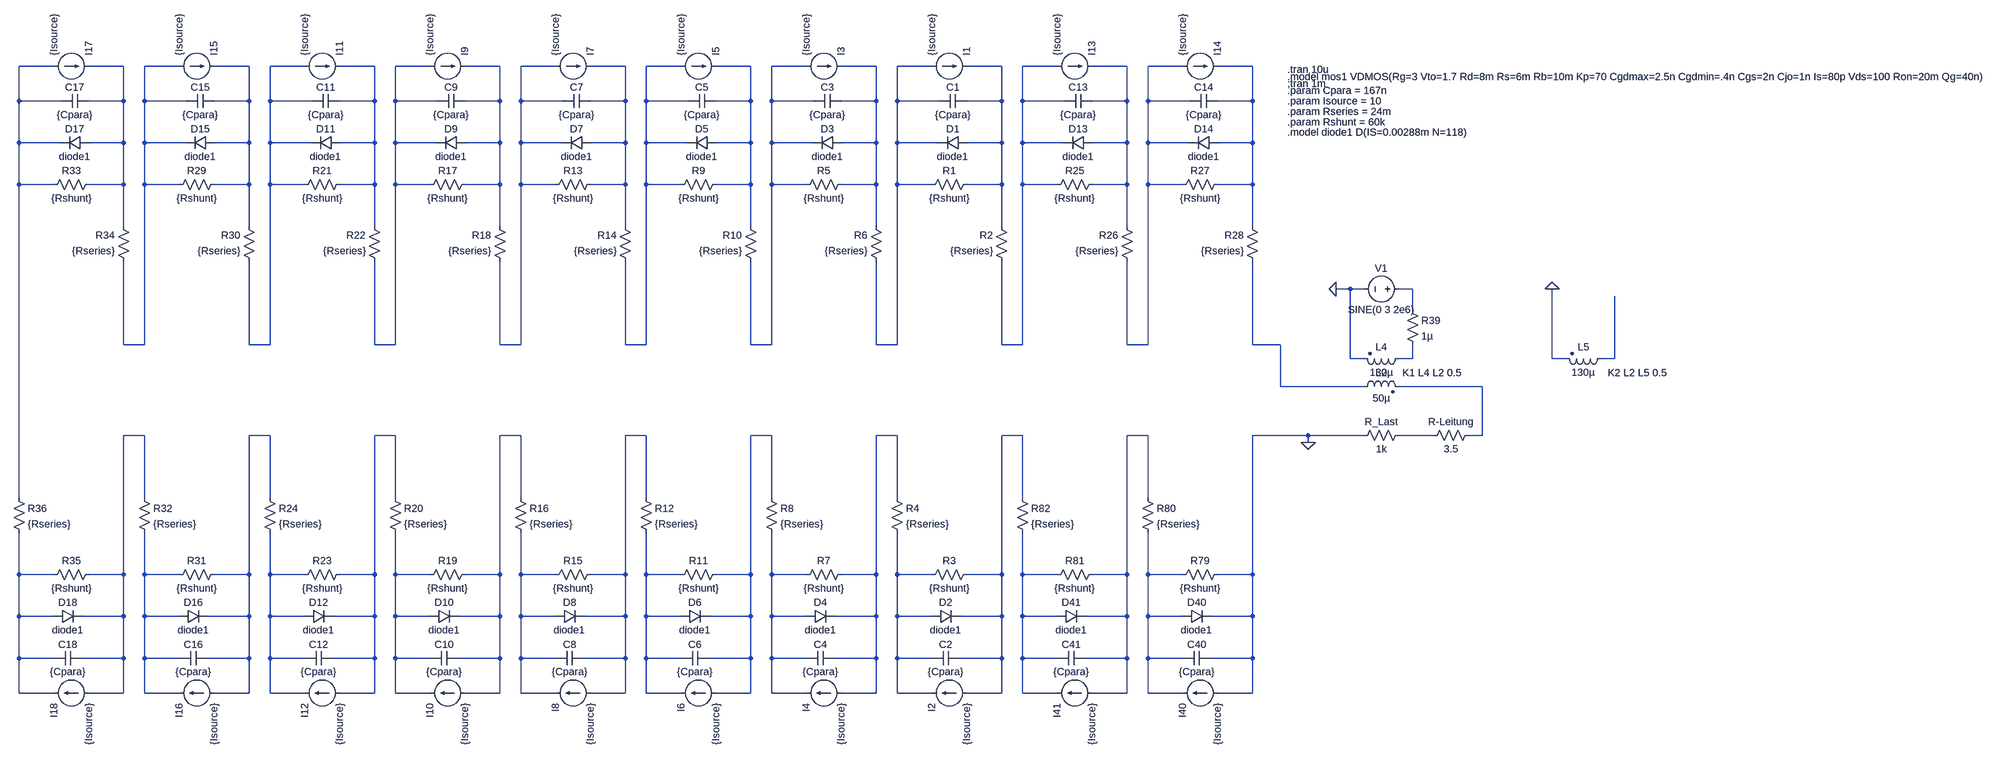
[diagram p0: schematic module-string-complete.asc]
module-string-complete.asc, the LTspice schematic file:
Version 4
SHEET 1 4972 1200
WIRE 1072 -384 992 -384
WIRE 1232 -384 1152 -384
WIRE 1360 -384 1280 -384
WIRE 1520 -384 1440 -384
WIRE 1648 -384 1568 -384
WIRE 1808 -384 1728 -384
WIRE 1936 -384 1856 -384
WIRE 2096 -384 2016 -384
WIRE 2224 -384 2144 -384
WIRE 2384 -384 2304 -384
WIRE 2512 -384 2432 -384
WIRE 2672 -384 2592 -384
WIRE 2800 -384 2720 -384
WIRE 2960 -384 2880 -384
WIRE 3088 -384 3008 -384
WIRE 3248 -384 3168 -384
WIRE 3376 -384 3296 -384
WIRE 3536 -384 3456 -384
WIRE 3664 -384 3584 -384
WIRE 3824 -384 3744 -384
WIRE 992 -304 992 -384
WIRE 1088 -304 992 -304
WIRE 1232 -304 1232 -384
WIRE 1232 -304 1152 -304
WIRE 1280 -304 1280 -384
WIRE 1376 -304 1280 -304
WIRE 1520 -304 1520 -384
WIRE 1520 -304 1440 -304
WIRE 1568 -304 1568 -384
WIRE 1664 -304 1568 -304
WIRE 1808 -304 1808 -384
WIRE 1808 -304 1728 -304
WIRE 1856 -304 1856 -384
WIRE 1952 -304 1856 -304
WIRE 2096 -304 2096 -384
WIRE 2096 -304 2016 -304
WIRE 2144 -304 2144 -384
WIRE 2240 -304 2144 -304
WIRE 2384 -304 2384 -384
WIRE 2384 -304 2304 -304
WIRE 2432 -304 2432 -384
WIRE 2528 -304 2432 -304
WIRE 2672 -304 2672 -384
WIRE 2672 -304 2592 -304
WIRE 2720 -304 2720 -384
WIRE 2816 -304 2720 -304
WIRE 2960 -304 2960 -384
WIRE 2960 -304 2880 -304
WIRE 3008 -304 3008 -384
WIRE 3104 -304 3008 -304
WIRE 3248 -304 3248 -384
WIRE 3248 -304 3168 -304
WIRE 3296 -304 3296 -384
WIRE 3392 -304 3296 -304
WIRE 3536 -304 3536 -384
WIRE 3536 -304 3456 -304
WIRE 3584 -304 3584 -384
WIRE 3680 -304 3584 -304
WIRE 3824 -304 3824 -384
WIRE 3824 -304 3744 -304
WIRE 992 -208 992 -304
WIRE 1088 -208 992 -208
WIRE 1232 -208 1232 -304
WIRE 1232 -208 1152 -208
WIRE 1280 -208 1280 -304
WIRE 1376 -208 1280 -208
WIRE 1520 -208 1520 -304
WIRE 1520 -208 1440 -208
WIRE 1568 -208 1568 -304
WIRE 1664 -208 1568 -208
WIRE 1808 -208 1808 -304
WIRE 1808 -208 1728 -208
WIRE 1856 -208 1856 -304
WIRE 1952 -208 1856 -208
WIRE 2096 -208 2096 -304
WIRE 2096 -208 2016 -208
WIRE 2144 -208 2144 -304
WIRE 2240 -208 2144 -208
WIRE 2384 -208 2384 -304
WIRE 2384 -208 2304 -208
WIRE 2432 -208 2432 -304
WIRE 2528 -208 2432 -208
WIRE 2672 -208 2672 -304
WIRE 2672 -208 2592 -208
WIRE 2720 -208 2720 -304
WIRE 2816 -208 2720 -208
WIRE 2960 -208 2960 -304
WIRE 2960 -208 2880 -208
WIRE 3008 -208 3008 -304
WIRE 3104 -208 3008 -208
WIRE 3248 -208 3248 -304
WIRE 3248 -208 3168 -208
WIRE 3296 -208 3296 -304
WIRE 3392 -208 3296 -208
WIRE 3536 -208 3536 -304
WIRE 3536 -208 3456 -208
WIRE 3584 -208 3584 -304
WIRE 3680 -208 3584 -208
WIRE 3824 -208 3824 -304
WIRE 3824 -208 3744 -208
WIRE 992 -112 992 -208
WIRE 1072 -112 992 -112
WIRE 1232 -112 1232 -208
WIRE 1232 -112 1152 -112
WIRE 1280 -112 1280 -208
WIRE 1360 -112 1280 -112
WIRE 1520 -112 1520 -208
WIRE 1520 -112 1440 -112
WIRE 1568 -112 1568 -208
WIRE 1648 -112 1568 -112
WIRE 1808 -112 1808 -208
WIRE 1808 -112 1728 -112
WIRE 1856 -112 1856 -208
WIRE 1936 -112 1856 -112
WIRE 2096 -112 2096 -208
WIRE 2096 -112 2016 -112
WIRE 2144 -112 2144 -208
WIRE 2224 -112 2144 -112
WIRE 2384 -112 2384 -208
WIRE 2384 -112 2304 -112
WIRE 2432 -112 2432 -208
WIRE 2512 -112 2432 -112
WIRE 2672 -112 2672 -208
WIRE 2672 -112 2592 -112
WIRE 2720 -112 2720 -208
WIRE 2800 -112 2720 -112
WIRE 2960 -112 2960 -208
WIRE 2960 -112 2880 -112
WIRE 3008 -112 3008 -208
WIRE 3088 -112 3008 -112
WIRE 3248 -112 3248 -208
WIRE 3248 -112 3168 -112
WIRE 3296 -112 3296 -208
WIRE 3376 -112 3296 -112
WIRE 3536 -112 3536 -208
WIRE 3536 -112 3456 -112
WIRE 3584 -112 3584 -208
WIRE 3664 -112 3584 -112
WIRE 3824 -112 3824 -208
WIRE 3824 -112 3744 -112
WIRE 1232 -16 1232 -112
WIRE 1520 -16 1520 -112
WIRE 1808 -16 1808 -112
WIRE 2096 -16 2096 -112
WIRE 2384 -16 2384 -112
WIRE 2672 -16 2672 -112
WIRE 2960 -16 2960 -112
WIRE 3248 -16 3248 -112
WIRE 3536 -16 3536 -112
WIRE 3824 -16 3824 -112
WIRE 4048 128 4016 128
WIRE 4080 128 4048 128
WIRE 4192 128 4160 128
WIRE 4192 176 4192 128
WIRE 1232 256 1232 64
WIRE 1280 256 1280 -112
WIRE 1280 256 1232 256
WIRE 1520 256 1520 64
WIRE 1568 256 1568 -112
WIRE 1568 256 1520 256
WIRE 1808 256 1808 64
WIRE 1856 256 1856 -112
WIRE 1856 256 1808 256
WIRE 2096 256 2096 64
WIRE 2144 256 2144 -112
WIRE 2144 256 2096 256
WIRE 2384 256 2384 64
WIRE 2432 256 2432 -112
WIRE 2432 256 2384 256
WIRE 2672 256 2672 64
WIRE 2720 256 2720 -112
WIRE 2720 256 2672 256
WIRE 2960 256 2960 64
WIRE 3008 256 3008 -112
WIRE 3008 256 2960 256
WIRE 3248 256 3248 64
WIRE 3296 256 3296 -112
WIRE 3296 256 3248 256
WIRE 3536 256 3536 64
WIRE 3584 256 3584 -112
WIRE 3584 256 3536 256
WIRE 3824 256 3824 64
WIRE 3888 256 3824 256
WIRE 4048 288 4048 128
WIRE 4080 288 4048 288
WIRE 4192 288 4192 256
WIRE 4192 288 4160 288
WIRE 4512 288 4512 128
WIRE 4544 288 4512 288
WIRE 4656 288 4656 144
WIRE 4656 288 4624 288
WIRE 3888 352 3888 256
WIRE 4080 352 3888 352
WIRE 4352 352 4160 352
WIRE 1280 464 1232 464
WIRE 1568 464 1520 464
WIRE 1856 464 1808 464
WIRE 2144 464 2096 464
WIRE 2432 464 2384 464
WIRE 2720 464 2672 464
WIRE 3008 464 2960 464
WIRE 3296 464 3248 464
WIRE 3584 464 3536 464
WIRE 3952 464 3824 464
WIRE 4080 464 3952 464
WIRE 4240 464 4160 464
WIRE 4352 464 4352 352
WIRE 4352 464 4320 464
WIRE 3952 480 3952 464
WIRE 992 656 992 -112
WIRE 1280 656 1280 464
WIRE 1568 656 1568 464
WIRE 1856 656 1856 464
WIRE 2144 656 2144 464
WIRE 2432 656 2432 464
WIRE 2720 656 2720 464
WIRE 3008 656 3008 464
WIRE 3296 656 3296 464
WIRE 3584 656 3584 464
WIRE 992 832 992 736
WIRE 1072 832 992 832
WIRE 1232 832 1232 464
WIRE 1232 832 1152 832
WIRE 1280 832 1280 736
WIRE 1360 832 1280 832
WIRE 1520 832 1520 464
WIRE 1520 832 1440 832
WIRE 1568 832 1568 736
WIRE 1648 832 1568 832
WIRE 1808 832 1808 464
WIRE 1808 832 1728 832
WIRE 1856 832 1856 736
WIRE 1936 832 1856 832
WIRE 2096 832 2096 464
WIRE 2096 832 2016 832
WIRE 2144 832 2144 736
WIRE 2224 832 2144 832
WIRE 2384 832 2384 464
WIRE 2384 832 2304 832
WIRE 2432 832 2432 736
WIRE 2512 832 2432 832
WIRE 2672 832 2672 464
WIRE 2672 832 2592 832
WIRE 2720 832 2720 736
WIRE 2800 832 2720 832
WIRE 2960 832 2960 464
WIRE 2960 832 2880 832
WIRE 3008 832 3008 736
WIRE 3088 832 3008 832
WIRE 3248 832 3248 464
WIRE 3248 832 3168 832
WIRE 3296 832 3296 736
WIRE 3376 832 3296 832
WIRE 3536 832 3536 464
WIRE 3536 832 3456 832
WIRE 3584 832 3584 736
WIRE 3664 832 3584 832
WIRE 3824 832 3824 464
WIRE 3824 832 3744 832
WIRE 992 928 992 832
WIRE 1072 928 992 928
WIRE 1232 928 1232 832
WIRE 1232 928 1136 928
WIRE 1280 928 1280 832
WIRE 1360 928 1280 928
WIRE 1520 928 1520 832
WIRE 1520 928 1424 928
WIRE 1568 928 1568 832
WIRE 1648 928 1568 928
WIRE 1808 928 1808 832
WIRE 1808 928 1712 928
WIRE 1856 928 1856 832
WIRE 1936 928 1856 928
WIRE 2096 928 2096 832
WIRE 2096 928 2000 928
WIRE 2144 928 2144 832
WIRE 2224 928 2144 928
WIRE 2384 928 2384 832
WIRE 2384 928 2288 928
WIRE 2432 928 2432 832
WIRE 2512 928 2432 928
WIRE 2672 928 2672 832
WIRE 2672 928 2576 928
WIRE 2720 928 2720 832
WIRE 2800 928 2720 928
WIRE 2960 928 2960 832
WIRE 2960 928 2864 928
WIRE 3008 928 3008 832
WIRE 3088 928 3008 928
WIRE 3248 928 3248 832
WIRE 3248 928 3152 928
WIRE 3296 928 3296 832
WIRE 3376 928 3296 928
WIRE 3536 928 3536 832
WIRE 3536 928 3440 928
WIRE 3584 928 3584 832
WIRE 3664 928 3584 928
WIRE 3824 928 3824 832
WIRE 3824 928 3728 928
WIRE 992 1024 992 928
WIRE 1072 1024 992 1024
WIRE 1232 1024 1232 928
WIRE 1232 1024 1136 1024
WIRE 1280 1024 1280 928
WIRE 1360 1024 1280 1024
WIRE 1520 1024 1520 928
WIRE 1520 1024 1424 1024
WIRE 1568 1024 1568 928
WIRE 1648 1024 1568 1024
WIRE 1808 1024 1808 928
WIRE 1808 1024 1712 1024
WIRE 1856 1024 1856 928
WIRE 1936 1024 1856 1024
WIRE 2096 1024 2096 928
WIRE 2096 1024 2000 1024
WIRE 2144 1024 2144 928
WIRE 2224 1024 2144 1024
WIRE 2384 1024 2384 928
WIRE 2384 1024 2288 1024
WIRE 2432 1024 2432 928
WIRE 2512 1024 2432 1024
WIRE 2672 1024 2672 928
WIRE 2672 1024 2576 1024
WIRE 2720 1024 2720 928
WIRE 2800 1024 2720 1024
WIRE 2960 1024 2960 928
WIRE 2960 1024 2864 1024
WIRE 3008 1024 3008 928
WIRE 3088 1024 3008 1024
WIRE 3248 1024 3248 928
WIRE 3248 1024 3152 1024
WIRE 3296 1024 3296 928
WIRE 3376 1024 3296 1024
WIRE 3536 1024 3536 928
WIRE 3536 1024 3440 1024
WIRE 3584 1024 3584 928
WIRE 3664 1024 3584 1024
WIRE 3824 1024 3824 928
WIRE 3824 1024 3728 1024
WIRE 992 1104 992 1024
WIRE 1072 1104 992 1104
WIRE 1232 1104 1232 1024
WIRE 1232 1104 1152 1104
WIRE 1280 1104 1280 1024
WIRE 1360 1104 1280 1104
WIRE 1520 1104 1520 1024
WIRE 1520 1104 1440 1104
WIRE 1568 1104 1568 1024
WIRE 1648 1104 1568 1104
WIRE 1808 1104 1808 1024
WIRE 1808 1104 1728 1104
WIRE 1856 1104 1856 1024
WIRE 1936 1104 1856 1104
WIRE 2096 1104 2096 1024
WIRE 2096 1104 2016 1104
WIRE 2144 1104 2144 1024
WIRE 2224 1104 2144 1104
WIRE 2384 1104 2384 1024
WIRE 2384 1104 2304 1104
WIRE 2432 1104 2432 1024
WIRE 2512 1104 2432 1104
WIRE 2672 1104 2672 1024
WIRE 2672 1104 2592 1104
WIRE 2720 1104 2720 1024
WIRE 2800 1104 2720 1104
WIRE 2960 1104 2960 1024
WIRE 2960 1104 2880 1104
WIRE 3008 1104 3008 1024
WIRE 3088 1104 3008 1104
WIRE 3248 1104 3248 1024
WIRE 3248 1104 3168 1104
WIRE 3296 1104 3296 1024
WIRE 3376 1104 3296 1104
WIRE 3536 1104 3536 1024
WIRE 3536 1104 3456 1104
WIRE 3584 1104 3584 1024
WIRE 3664 1104 3584 1104
WIRE 3824 1104 3824 1024
WIRE 3824 1104 3744 1104
FLAG 3952 480 0
FLAG 4016 128 0
FLAG 4512 128 0
SYMBOL current 3376 -384 R270
WINDOW 0 24 80 Left 2
WINDOW 3 24 0 Left 2
WINDOW 123 0 0 Left 2
WINDOW 39 0 0 Left 2
SYMATTR InstName I13
SYMATTR Value {Isource}
SYMBOL cap 3456 -320 R90
WINDOW 0 0 32 VBottom 2
WINDOW 3 32 32 VTop 2
SYMATTR InstName C13
SYMATTR Value {Cpara}
SYMBOL diode 3456 -224 R90
WINDOW 0 0 32 VBottom 2
WINDOW 3 32 32 VTop 2
SYMATTR InstName D13
SYMATTR Value diode1
SYMBOL res 3472 -128 R90
WINDOW 0 0 56 VBottom 2
WINDOW 3 32 56 VTop 2
SYMATTR InstName R25
SYMATTR Value {Rshunt}
SYMBOL res 3552 80 R180
WINDOW 0 36 76 Left 2
WINDOW 3 36 40 Left 2
SYMATTR InstName R26
SYMATTR Value {Rseries}
SYMBOL current 3664 -384 R270
WINDOW 0 24 80 Left 2
WINDOW 3 24 0 Left 2
WINDOW 123 0 0 Left 2
WINDOW 39 0 0 Left 2
SYMATTR InstName I14
SYMATTR Value {Isource}
SYMBOL cap 3744 -320 R90
WINDOW 0 0 32 VBottom 2
WINDOW 3 32 32 VTop 2
SYMATTR InstName C14
SYMATTR Value {Cpara}
SYMBOL diode 3744 -224 R90
WINDOW 0 0 32 VBottom 2
WINDOW 3 32 32 VTop 2
SYMATTR InstName D14
SYMATTR Value diode1
SYMBOL res 3760 -128 R90
WINDOW 0 0 56 VBottom 2
WINDOW 3 32 56 VTop 2
SYMATTR InstName R27
SYMATTR Value {Rshunt}
SYMBOL res 3840 80 R180
WINDOW 0 36 76 Left 2
WINDOW 3 36 40 Left 2
SYMATTR InstName R28
SYMATTR Value {Rseries}
SYMBOL current 3744 1104 R90
WINDOW 0 24 80 Left 2
WINDOW 3 24 0 Left 2
WINDOW 123 0 0 Left 2
WINDOW 39 0 0 Left 2
SYMATTR InstName I40
SYMATTR Value {Isource}
SYMBOL cap 3664 1040 R270
WINDOW 0 32 32 VTop 2
WINDOW 3 0 32 VBottom 2
SYMATTR InstName C40
SYMATTR Value {Cpara}
SYMBOL diode 3664 944 R270
WINDOW 0 32 32 VTop 2
WINDOW 3 0 32 VBottom 2
SYMATTR InstName D40
SYMATTR Value diode1
SYMBOL res 3648 848 R270
WINDOW 0 32 56 VTop 2
WINDOW 3 0 56 VBottom 2
SYMATTR InstName R79
SYMATTR Value {Rshunt}
SYMBOL res 3568 640 R0
SYMATTR InstName R80
SYMATTR Value {Rseries}
SYMBOL current 3456 1104 R90
WINDOW 0 24 80 Left 2
WINDOW 3 24 0 Left 2
WINDOW 123 0 0 Left 2
WINDOW 39 0 0 Left 2
SYMATTR InstName I41
SYMATTR Value {Isource}
SYMBOL cap 3376 1040 R270
WINDOW 0 32 32 VTop 2
WINDOW 3 0 32 VBottom 2
SYMATTR InstName C41
SYMATTR Value {Cpara}
SYMBOL diode 3376 944 R270
WINDOW 0 32 32 VTop 2
WINDOW 3 0 32 VBottom 2
SYMATTR InstName D41
SYMATTR Value diode1
SYMBOL res 3360 848 R270
WINDOW 0 32 56 VTop 2
WINDOW 3 0 56 VBottom 2
SYMATTR InstName R81
SYMATTR Value {Rshunt}
SYMBOL res 3280 640 R0
SYMATTR InstName R82
SYMATTR Value {Rseries}
SYMBOL current 3088 -384 R270
WINDOW 0 24 80 Left 2
WINDOW 3 24 0 Left 2
WINDOW 123 0 0 Left 2
WINDOW 39 0 0 Left 2
SYMATTR InstName I1
SYMATTR Value {Isource}
SYMBOL cap 3168 -320 R90
WINDOW 0 0 32 VBottom 2
WINDOW 3 32 32 VTop 2
SYMATTR InstName C1
SYMATTR Value {Cpara}
SYMBOL diode 3168 -224 R90
WINDOW 0 0 32 VBottom 2
WINDOW 3 32 32 VTop 2
SYMATTR InstName D1
SYMATTR Value diode1
SYMBOL res 3184 -128 R90
WINDOW 0 0 56 VBottom 2
WINDOW 3 32 56 VTop 2
SYMATTR InstName R1
SYMATTR Value {Rshunt}
SYMBOL res 3264 80 R180
WINDOW 0 36 76 Left 2
WINDOW 3 36 40 Left 2
SYMATTR InstName R2
SYMATTR Value {Rseries}
SYMBOL current 3168 1104 R90
WINDOW 0 24 80 Left 2
WINDOW 3 24 0 Left 2
WINDOW 123 0 0 Left 2
WINDOW 39 0 0 Left 2
SYMATTR InstName I2
SYMATTR Value {Isource}
SYMBOL cap 3088 1040 R270
WINDOW 0 32 32 VTop 2
WINDOW 3 0 32 VBottom 2
SYMATTR InstName C2
SYMATTR Value {Cpara}
SYMBOL diode 3088 944 R270
WINDOW 0 32 32 VTop 2
WINDOW 3 0 32 VBottom 2
SYMATTR InstName D2
SYMATTR Value diode1
SYMBOL res 3072 848 R270
WINDOW 0 32 56 VTop 2
WINDOW 3 0 56 VBottom 2
SYMATTR InstName R3
SYMATTR Value {Rshunt}
SYMBOL res 2992 640 R0
SYMATTR InstName R4
SYMATTR Value {Rseries}
SYMBOL current 2800 -384 R270
WINDOW 0 24 80 Left 2
WINDOW 3 24 0 Left 2
WINDOW 123 0 0 Left 2
WINDOW 39 0 0 Left 2
SYMATTR InstName I3
SYMATTR Value {Isource}
SYMBOL cap 2880 -320 R90
WINDOW 0 0 32 VBottom 2
WINDOW 3 32 32 VTop 2
SYMATTR InstName C3
SYMATTR Value {Cpara}
SYMBOL diode 2880 -224 R90
WINDOW 0 0 32 VBottom 2
WINDOW 3 32 32 VTop 2
SYMATTR InstName D3
SYMATTR Value diode1
SYMBOL res 2896 -128 R90
WINDOW 0 0 56 VBottom 2
WINDOW 3 32 56 VTop 2
SYMATTR InstName R5
SYMATTR Value {Rshunt}
SYMBOL res 2976 80 R180
WINDOW 0 36 76 Left 2
WINDOW 3 36 40 Left 2
SYMATTR InstName R6
SYMATTR Value {Rseries}
SYMBOL current 2880 1104 R90
WINDOW 0 24 80 Left 2
WINDOW 3 24 0 Left 2
WINDOW 123 0 0 Left 2
WINDOW 39 0 0 Left 2
SYMATTR InstName I4
SYMATTR Value {Isource}
SYMBOL cap 2800 1040 R270
WINDOW 0 32 32 VTop 2
WINDOW 3 0 32 VBottom 2
SYMATTR InstName C4
SYMATTR Value {Cpara}
SYMBOL diode 2800 944 R270
WINDOW 0 32 32 VTop 2
WINDOW 3 0 32 VBottom 2
SYMATTR InstName D4
SYMATTR Value diode1
SYMBOL res 2784 848 R270
WINDOW 0 32 56 VTop 2
WINDOW 3 0 56 VBottom 2
SYMATTR InstName R7
SYMATTR Value {Rshunt}
SYMBOL res 2704 640 R0
SYMATTR InstName R8
SYMATTR Value {Rseries}
SYMBOL current 2512 -384 R270
WINDOW 0 24 80 Left 2
WINDOW 3 24 0 Left 2
WINDOW 123 0 0 Left 2
WINDOW 39 0 0 Left 2
SYMATTR InstName I5
SYMATTR Value {Isource}
SYMBOL cap 2592 -320 R90
WINDOW 0 0 32 VBottom 2
WINDOW 3 32 32 VTop 2
SYMATTR InstName C5
SYMATTR Value {Cpara}
SYMBOL diode 2592 -224 R90
WINDOW 0 0 32 VBottom 2
WINDOW 3 32 32 VTop 2
SYMATTR InstName D5
SYMATTR Value diode1
SYMBOL res 2608 -128 R90
WINDOW 0 0 56 VBottom 2
WINDOW 3 32 56 VTop 2
SYMATTR InstName R9
SYMATTR Value {Rshunt}
SYMBOL res 2688 80 R180
WINDOW 0 36 76 Left 2
WINDOW 3 36 40 Left 2
SYMATTR InstName R10
SYMATTR Value {Rseries}
SYMBOL current 2592 1104 R90
WINDOW 0 24 80 Left 2
WINDOW 3 24 0 Left 2
WINDOW 123 0 0 Left 2
WINDOW 39 0 0 Left 2
SYMATTR InstName I6
SYMATTR Value {Isource}
SYMBOL cap 2512 1040 R270
WINDOW 0 32 32 VTop 2
WINDOW 3 0 32 VBottom 2
SYMATTR InstName C6
SYMATTR Value {Cpara}
SYMBOL diode 2512 944 R270
WINDOW 0 32 32 VTop 2
WINDOW 3 0 32 VBottom 2
SYMATTR InstName D6
SYMATTR Value diode1
SYMBOL res 2496 848 R270
WINDOW 0 32 56 VTop 2
WINDOW 3 0 56 VBottom 2
SYMATTR InstName R11
SYMATTR Value {Rshunt}
SYMBOL res 2416 640 R0
SYMATTR InstName R12
SYMATTR Value {Rseries}
SYMBOL current 2224 -384 R270
WINDOW 0 24 80 Left 2
WINDOW 3 24 0 Left 2
WINDOW 123 0 0 Left 2
WINDOW 39 0 0 Left 2
SYMATTR InstName I7
SYMATTR Value {Isource}
SYMBOL cap 2304 -320 R90
WINDOW 0 0 32 VBottom 2
WINDOW 3 32 32 VTop 2
SYMATTR InstName C7
SYMATTR Value {Cpara}
SYMBOL diode 2304 -224 R90
WINDOW 0 0 32 VBottom 2
WINDOW 3 32 32 VTop 2
SYMATTR InstName D7
SYMATTR Value diode1
SYMBOL res 2320 -128 R90
WINDOW 0 0 56 VBottom 2
WINDOW 3 32 56 VTop 2
SYMATTR InstName R13
SYMATTR Value {Rshunt}
SYMBOL res 2400 80 R180
WINDOW 0 36 76 Left 2
WINDOW 3 36 40 Left 2
SYMATTR InstName R14
SYMATTR Value {Rseries}
SYMBOL current 2304 1104 R90
WINDOW 0 24 80 Left 2
WINDOW 3 24 0 Left 2
WINDOW 123 0 0 Left 2
WINDOW 39 0 0 Left 2
SYMATTR InstName I8
SYMATTR Value {Isource}
SYMBOL cap 2224 1040 R270
WINDOW 0 32 32 VTop 2
WINDOW 3 0 32 VBottom 2
SYMATTR InstName C8
SYMATTR Value {Cpara}
SYMBOL diode 2224 944 R270
WINDOW 0 32 32 VTop 2
WINDOW 3 0 32 VBottom 2
SYMATTR InstName D8
SYMATTR Value diode1
SYMBOL res 2208 848 R270
WINDOW 0 32 56 VTop 2
WINDOW 3 0 56 VBottom 2
SYMATTR InstName R15
SYMATTR Value {Rshunt}
SYMBOL res 2128 640 R0
SYMATTR InstName R16
SYMATTR Value {Rseries}
SYMBOL current 1936 -384 R270
WINDOW 0 24 80 Left 2
WINDOW 3 24 0 Left 2
WINDOW 123 0 0 Left 2
WINDOW 39 0 0 Left 2
SYMATTR InstName I9
SYMATTR Value {Isource}
SYMBOL cap 2016 -320 R90
WINDOW 0 0 32 VBottom 2
WINDOW 3 32 32 VTop 2
SYMATTR InstName C9
SYMATTR Value {Cpara}
SYMBOL diode 2016 -224 R90
WINDOW 0 0 32 VBottom 2
WINDOW 3 32 32 VTop 2
SYMATTR InstName D9
SYMATTR Value diode1
SYMBOL res 2032 -128 R90
WINDOW 0 0 56 VBottom 2
WINDOW 3 32 56 VTop 2
SYMATTR InstName R17
SYMATTR Value {Rshunt}
SYMBOL res 2112 80 R180
WINDOW 0 36 76 Left 2
WINDOW 3 36 40 Left 2
SYMATTR InstName R18
SYMATTR Value {Rseries}
SYMBOL current 2016 1104 R90
WINDOW 0 24 80 Left 2
WINDOW 3 24 0 Left 2
WINDOW 123 0 0 Left 2
WINDOW 39 0 0 Left 2
SYMATTR InstName I10
SYMATTR Value {Isource}
SYMBOL cap 1936 1040 R270
WINDOW 0 32 32 VTop 2
WINDOW 3 0 32 VBottom 2
SYMATTR InstName C10
SYMATTR Value {Cpara}
SYMBOL diode 1936 944 R270
WINDOW 0 32 32 VTop 2
WINDOW 3 0 32 VBottom 2
SYMATTR InstName D10
SYMATTR Value diode1
SYMBOL res 1920 848 R270
WINDOW 0 32 56 VTop 2
WINDOW 3 0 56 VBottom 2
SYMATTR InstName R19
SYMATTR Value {Rshunt}
SYMBOL res 1840 640 R0
SYMATTR InstName R20
SYMATTR Value {Rseries}
SYMBOL current 1648 -384 R270
WINDOW 0 24 80 Left 2
WINDOW 3 24 0 Left 2
WINDOW 123 0 0 Left 2
WINDOW 39 0 0 Left 2
SYMATTR InstName I11
SYMATTR Value {Isource}
SYMBOL cap 1728 -320 R90
WINDOW 0 0 32 VBottom 2
WINDOW 3 32 32 VTop 2
SYMATTR InstName C11
SYMATTR Value {Cpara}
SYMBOL diode 1728 -224 R90
WINDOW 0 0 32 VBottom 2
WINDOW 3 32 32 VTop 2
SYMATTR InstName D11
SYMATTR Value diode1
SYMBOL res 1744 -128 R90
WINDOW 0 0 56 VBottom 2
WINDOW 3 32 56 VTop 2
SYMATTR InstName R21
SYMATTR Value {Rshunt}
SYMBOL res 1824 80 R180
WINDOW 0 36 76 Left 2
WINDOW 3 36 40 Left 2
SYMATTR InstName R22
SYMATTR Value {Rseries}
SYMBOL current 1728 1104 R90
WINDOW 0 24 80 Left 2
WINDOW 3 24 0 Left 2
WINDOW 123 0 0 Left 2
WINDOW 39 0 0 Left 2
SYMATTR InstName I12
SYMATTR Value {Isource}
SYMBOL cap 1648 1040 R270
WINDOW 0 32 32 VTop 2
WINDOW 3 0 32 VBottom 2
SYMATTR InstName C12
SYMATTR Value {Cpara}
SYMBOL diode 1648 944 R270
WINDOW 0 32 32 VTop 2
WINDOW 3 0 32 VBottom 2
SYMATTR InstName D12
SYMATTR Value diode1
SYMBOL res 1632 848 R270
WINDOW 0 32 56 VTop 2
WINDOW 3 0 56 VBottom 2
SYMATTR InstName R23
SYMATTR Value {Rshunt}
SYMBOL res 1552 640 R0
SYMATTR InstName R24
SYMATTR Value {Rseries}
SYMBOL current 1360 -384 R270
WINDOW 0 24 80 Left 2
WINDOW 3 24 0 Left 2
WINDOW 123 0 0 Left 2
WINDOW 39 0 0 Left 2
SYMATTR InstName I15
SYMATTR Value {Isource}
SYMBOL cap 1440 -320 R90
WINDOW 0 0 32 VBottom 2
WINDOW 3 32 32 VTop 2
SYMATTR InstName C15
SYMATTR Value {Cpara}
SYMBOL diode 1440 -224 R90
WINDOW 0 0 32 VBottom 2
WINDOW 3 32 32 VTop 2
SYMATTR InstName D15
SYMATTR Value diode1
SYMBOL res 1456 -128 R90
WINDOW 0 0 56 VBottom 2
WINDOW 3 32 56 VTop 2
SYMATTR InstName R29
SYMATTR Value {Rshunt}
SYMBOL res 1536 80 R180
WINDOW 0 36 76 Left 2
WINDOW 3 36 40 Left 2
SYMATTR InstName R30
SYMATTR Value {Rseries}
SYMBOL current 1440 1104 R90
WINDOW 0 24 80 Left 2
WINDOW 3 24 0 Left 2
WINDOW 123 0 0 Left 2
WINDOW 39 0 0 Left 2
SYMATTR InstName I16
SYMATTR Value {Isource}
SYMBOL cap 1360 1040 R270
WINDOW 0 32 32 VTop 2
WINDOW 3 0 32 VBottom 2
SYMATTR InstName C16
SYMATTR Value {Cpara}
SYMBOL diode 1360 944 R270
WINDOW 0 32 32 VTop 2
WINDOW 3 0 32 VBottom 2
SYMATTR InstName D16
SYMATTR Value diode1
SYMBOL res 1344 848 R270
WINDOW 0 32 56 VTop 2
WINDOW 3 0 56 VBottom 2
SYMATTR InstName R31
SYMATTR Value {Rshunt}
SYMBOL res 1264 640 R0
SYMATTR InstName R32
SYMATTR Value {Rseries}
SYMBOL current 1072 -384 R270
WINDOW 0 24 80 Left 2
WINDOW 3 24 0 Left 2
WINDOW 123 0 0 Left 2
WINDOW 39 0 0 Left 2
SYMATTR InstName I17
SYMATTR Value {Isource}
SYMBOL cap 1152 -320 R90
WINDOW 0 0 32 VBottom 2
WINDOW 3 32 32 VTop 2
SYMATTR InstName C17
SYMATTR Value {Cpara}
SYMBOL diode 1152 -224 R90
WINDOW 0 0 32 VBottom 2
WINDOW 3 32 32 VTop 2
SYMATTR InstName D17
SYMATTR Value diode1
SYMBOL res 1168 -128 R90
WINDOW 0 0 56 VBottom 2
WINDOW 3 32 56 VTop 2
SYMATTR InstName R33
SYMATTR Value {Rshunt}
SYMBOL res 1248 80 R180
WINDOW 0 36 76 Left 2
WINDOW 3 36 40 Left 2
SYMATTR InstName R34
SYMATTR Value {Rseries}
SYMBOL current 1152 1104 R90
WINDOW 0 24 80 Left 2
WINDOW 3 24 0 Left 2
WINDOW 123 0 0 Left 2
WINDOW 39 0 0 Left 2
SYMATTR InstName I18
SYMATTR Value {Isource}
SYMBOL cap 1072 1040 R270
WINDOW 0 32 32 VTop 2
WINDOW 3 0 32 VBottom 2
SYMATTR InstName C18
SYMATTR Value {Cpara}
SYMBOL diode 1072 944 R270
WINDOW 0 32 32 VTop 2
WINDOW 3 0 32 VBottom 2
SYMATTR InstName D18
SYMATTR Value diode1
SYMBOL res 1056 848 R270
WINDOW 0 32 56 VTop 2
WINDOW 3 0 56 VBottom 2
SYMATTR InstName R35
SYMATTR Value {Rshunt}
SYMBOL res 976 640 R0
SYMATTR InstName R36
SYMATTR Value {Rseries}
SYMBOL ind2 4064 368 R270
WINDOW 0 32 56 VTop 2
WINDOW 3 5 56 VBottom 2
SYMATTR InstName L2
SYMATTR Value 50µ
SYMATTR Type ind
SYMBOL ind2 4176 272 R90
WINDOW 0 5 56 VBottom 2
WINDOW 3 32 56 VTop 2
SYMATTR InstName L4
SYMATTR Value 130µ
SYMATTR Type ind
SYMBOL ind2 4640 272 R90
WINDOW 0 5 56 VBottom 2
WINDOW 3 32 56 VTop 2
SYMATTR InstName L5
SYMATTR Value 130µ
SYMATTR Type ind
SYMBOL res 4336 448 R90
WINDOW 0 0 56 VBottom 2
WINDOW 3 32 56 VTop 2
SYMATTR InstName R-Leitung
SYMATTR Value 3.5
SYMBOL voltage 4176 128 R90
WINDOW 0 -32 56 VBottom 2
WINDOW 3 32 56 VTop 2
WINDOW 123 0 0 Left 2
WINDOW 39 0 0 Left 2
SYMATTR InstName V1
SYMATTR Value SINE(0 3 2e6)
SYMBOL res 4176 160 R0
SYMATTR InstName R39
SYMATTR Value 1µ
SYMBOL res 4176 448 R90
WINDOW 0 0 56 VBottom 2
WINDOW 3 32 56 VTop 2
SYMATTR InstName R_Last
SYMATTR Value 1k
TEXT 3904 -232 Left 2 !.model diode1 D(IS=0.00288m N=118)
TEXT 3904 -344 Left 2 !;tran 1m
TEXT 3904 -256 Left 2 !.param Rshunt = 60k
TEXT 3904 -280 Left 2 !.param Rseries = 24m
TEXT 3904 -328 Left 2 !.param Cpara = 167n
TEXT 3904 -304 Left 2 !.param Isource = 10
TEXT 3904 -360 Left 2 !.model mos1 VDMOS(Rg=3 Vto=1.7 Rd=8m Rs=6m Rb=10m Kp=70 Cgdmax=2.5n Cgdmin=.4n Cgs=2n Cjo=1n Is=80p Vds=100 Ron=20m Qg=40n)
TEXT 3904 -376 Left 2 !.tran 10u
TEXT 4168 320 Left 2 !K1 L4 L2 0.5
TEXT 4640 320 Left 2 !K2 L2 L5 0.5

The netlist it stands for:
* module-string-complete.asc
I13 N017 N018 {Isource}
C13 N018 N017 {Cpara}
D13 N018 N017 diode1
R25 N018 N017 {Rshunt}
R26 N019 N018 {Rseries}
I14 N019 N020 {Isource}
C14 N020 N019 {Cpara}
D14 N020 N019 diode1
R27 N020 N019 {Rshunt}
R28 N022 N020 {Rseries}
I40 0 N045 {Isource}
C40 N045 0 {Cpara}
D40 N045 0 diode1
R79 N045 0 {Rshunt}
R80 N034 N045 {Rseries}
I41 N034 N044 {Isource}
C41 N044 N034 {Cpara}
D41 N044 N034 diode1
R81 N044 N034 {Rshunt}
R82 N033 N044 {Rseries}
I1 N015 N016 {Isource}
C1 N016 N015 {Cpara}
D1 N016 N015 diode1
R1 N016 N015 {Rshunt}
R2 N017 N016 {Rseries}
I2 N033 N043 {Isource}
C2 N043 N033 {Cpara}
D2 N043 N033 diode1
R3 N043 N033 {Rshunt}
R4 N032 N043 {Rseries}
I3 N013 N014 {Isource}
C3 N014 N013 {Cpara}
D3 N014 N013 diode1
R5 N014 N013 {Rshunt}
R6 N015 N014 {Rseries}
I4 N032 N042 {Isource}
C4 N042 N032 {Cpara}
D4 N042 N032 diode1
R7 N042 N032 {Rshunt}
R8 N031 N042 {Rseries}
I5 N011 N012 {Isource}
C5 N012 N011 {Cpara}
D5 N012 N011 diode1
R9 N012 N011 {Rshunt}
R10 N013 N012 {Rseries}
I6 N031 N041 {Isource}
C6 N041 N031 {Cpara}
D6 N041 N031 diode1
R11 N041 N031 {Rshunt}
R12 N030 N041 {Rseries}
I7 N009 N010 {Isource}
C7 N010 N009 {Cpara}
D7 N010 N009 diode1
R13 N010 N009 {Rshunt}
R14 N011 N010 {Rseries}
I8 N030 N040 {Isource}
C8 N040 N030 {Cpara}
D8 N040 N030 diode1
R15 N040 N030 {Rshunt}
R16 N029 N040 {Rseries}
I9 N007 N008 {Isource}
C9 N008 N007 {Cpara}
D9 N008 N007 diode1
R17 N008 N007 {Rshunt}
R18 N009 N008 {Rseries}
I10 N029 N039 {Isource}
C10 N039 N029 {Cpara}
D10 N039 N029 diode1
R19 N039 N029 {Rshunt}
R20 N028 N039 {Rseries}
I11 N005 N006 {Isource}
C11 N006 N005 {Cpara}
D11 N006 N005 diode1
R21 N006 N005 {Rshunt}
R22 N007 N006 {Rseries}
I12 N028 N038 {Isource}
C12 N038 N028 {Cpara}
D12 N038 N028 diode1
R23 N038 N028 {Rshunt}
R24 N027 N038 {Rseries}
I15 N003 N004 {Isource}
C15 N004 N003 {Cpara}
D15 N004 N003 diode1
R29 N004 N003 {Rshunt}
R30 N005 N004 {Rseries}
I16 N027 N037 {Isource}
C16 N037 N027 {Cpara}
D16 N037 N027 diode1
R31 N037 N027 {Rshunt}
R32 N026 N037 {Rseries}
I17 N001 N002 {Isource}
C17 N002 N001 {Cpara}
D17 N002 N001 diode1
R33 N002 N001 {Rshunt}
R34 N003 N002 {Rseries}
I18 N026 N036 {Isource}
C18 N036 N026 {Cpara}
D18 N036 N026 diode1
R35 N036 N026 {Rshunt}
R36 N001 N036 {Rseries}
L2 N022 N025 50µ
L4 N023 0 130µ
L5 N024 0 130µ
R-Leitung N025 N035 3.5
V1 N021 0 SINE(0 3 2e6)
R39 N021 N023 1µ
R_Last N035 0 1k
.model D D
.lib standard.dio
.model diode1 D(IS=0.00288m N=118)
;tran 1m
.param Rshunt = 60k
.param Rseries = 24m
.param Cpara = 167n
.param Isource = 10
.model mos1 VDMOS(Rg=3 Vto=1.7 Rd=8m Rs=6m Rb=10m Kp=70 Cgdmax=2.5n Cgdmin=.4n Cgs=2n Cjo=1n Is=80p Vds=100 Ron=20m Qg=40n)
.tran 10u
K1 L4 L2 0.5
K2 L2 L5 0.5
.backanno
.end